# EAGLE design 128A Breakout V1.1 (EAGLE 6.4)
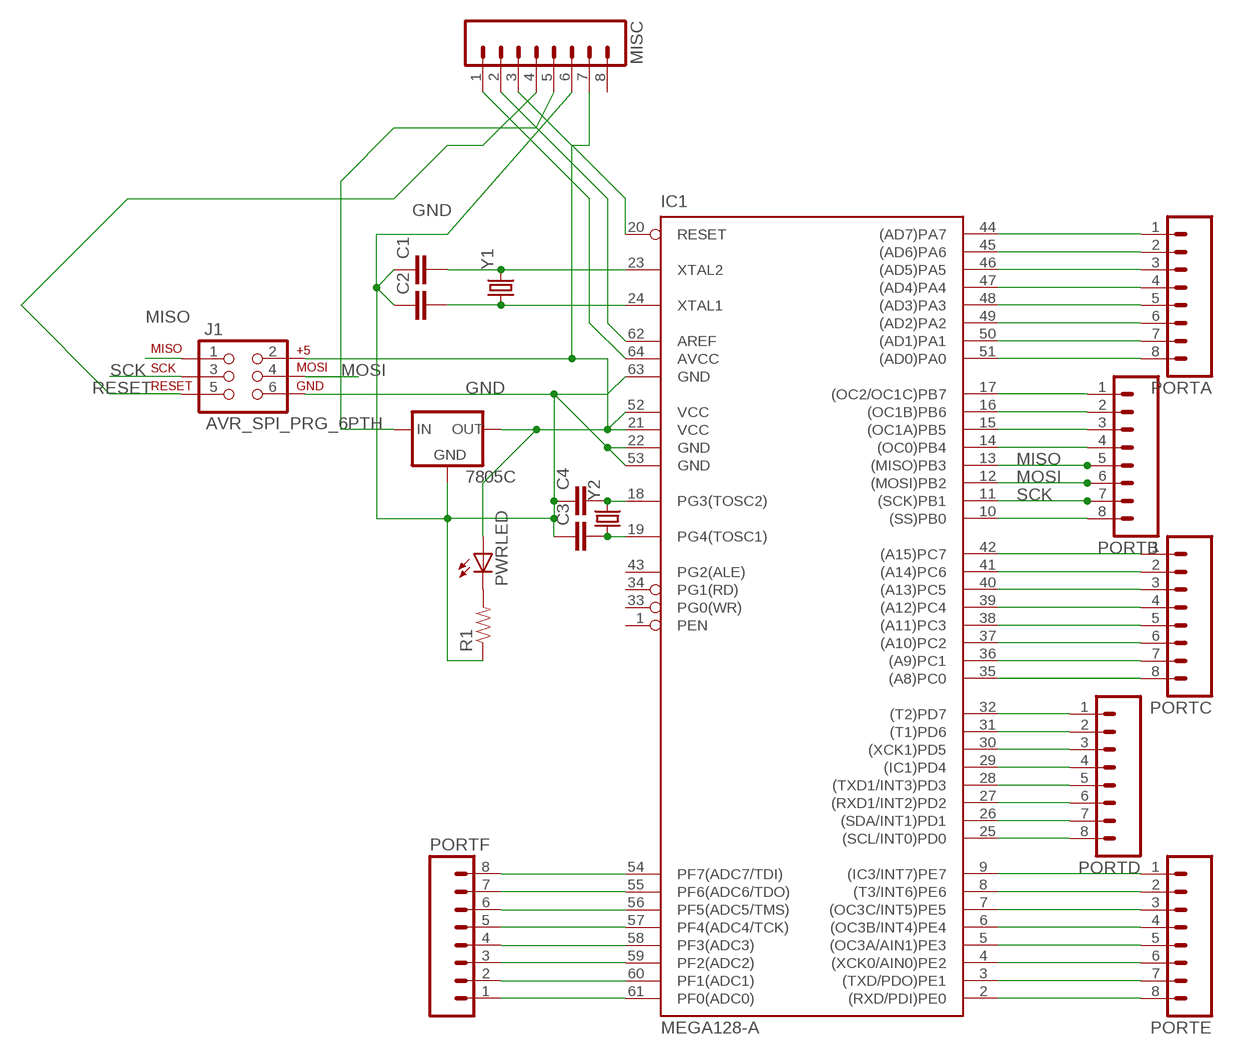
[diagram p0: schematic, sheet 1]

## Parts
7805C  V_REG_78XXSIDE  [78XXL]
C1  CAP1206  [1206]
C2  CAP1206  [1206]
C3  CAP1206  [1206]
C4  CAP1206  [1206]
IC1  MEGA128-A  [TQFP64]
J1  AVR_SPI_PRG_6PTH  [2X3]
MISC  M081X08  [1X08]
PORTA  M081X08  [1X08]
PORTB  M081X08  [1X08]
PORTC  M081X08  [1X08]
PORTD  M081X08  [1X08]
PORTE  M081X08  [1X08]
PORTF  M081X08  [1X08]
PWRLED  LED-FKIT-1206  [FKIT-LED-1206]
R1  RESISTOR1206  [1206]
Y1  CRYSTALHC49US  [HC49US]
Y2  CRYSTALTC26H_EZ  [TC26HEZ]

## Nets
5V: 7805C.OUT IC1.21(VCC) IC1.52(VCC) J1.2 MISC.7 PWRLED.A
GND: 7805C.GND C1.1 C2.1 C3.1 C4.1 IC1.22(GND) IC1.53(GND) IC1.63(GND) J1.6 MISC.6 R1.1
MISO: IC1.13((MISO)PB3) J1.1 PORTB.5
MOSI: IC1.12((MOSI)PB2) J1.4 PORTB.6
N$1: IC1.54(PF7(ADC7/TDI)) PORTF.8
N$2: C4.2 IC1.18(PG3(TOSC2)) Y2.2
N$3: C2.2 IC1.24(XTAL1) Y1.1
N$4: C1.2 IC1.23(XTAL2) Y1.2
N$5: IC1.55(PF6(ADC6/TDO)) PORTF.7
N$6: C3.2 IC1.19(PG4(TOSC1)) Y2.1
N$7: IC1.56(PF5(ADC5/TMS)) PORTF.6
N$8: IC1.57(PF4(ADC4/TCK)) PORTF.5
N$9: IC1.58(PF3(ADC3)) PORTF.4
N$10: IC1.59(PF2(ADC2)) PORTF.3
N$11: IC1.60(PF1(ADC1)) PORTF.2
N$12: IC1.61(PF0(ADC0)) PORTF.1
N$13: IC1.9((IC3/INT7)PE7) PORTE.1
N$14: IC1.8((T3/INT6)PE6) PORTE.2
N$15: IC1.7((OC3C/INT5)PE5) PORTE.3
N$16: IC1.6((OC3B/INT4)PE4) PORTE.4
N$17: IC1.5((OC3A/AIN1)PE3) PORTE.5
N$18: IC1.4((XCK0/AIN0)PE2) PORTE.6
N$19: IC1.3((TXD/PDO)PE1) PORTE.7
N$20: IC1.2((RXD/PDI)PE0) PORTE.8
N$21: IC1.32((T2)PD7) PORTD.1
N$22: IC1.31((T1)PD6) PORTD.2
N$23: IC1.30((XCK1)PD5) PORTD.3
N$24: IC1.29((IC1)PD4) PORTD.4
N$25: IC1.28((TXD1/INT3)PD3) PORTD.5
N$26: IC1.27((RXD1/INT2)PD2) PORTD.6
N$27: IC1.26((SDA/INT1)PD1) PORTD.7
N$28: IC1.25((SCL/INT0)PD0) PORTD.8
N$29: IC1.42((A15)PC7) PORTC.1
N$30: IC1.41((A14)PC6) PORTC.2
N$31: IC1.40((A13)PC5) PORTC.3
N$32: IC1.39((A12)PC4) PORTC.4
N$33: IC1.38((A11)PC3) PORTC.5
N$34: IC1.37((A10)PC2) PORTC.6
N$35: IC1.36((A9)PC1) PORTC.7
N$36: IC1.35((A8)PC0) PORTC.8
N$37: IC1.17((OC2/OC1C)PB7) PORTB.1
N$38: IC1.16((OC1B)PB6) PORTB.2
N$39: IC1.15((OC1A)PB5) PORTB.3
N$40: IC1.14((OC0)PB4) PORTB.4
N$41: IC1.10((SS)PB0) PORTB.8
N$42: IC1.44((AD7)PA7) PORTA.1
N$43: IC1.45((AD6)PA6) PORTA.2
N$44: IC1.46((AD5)PA5) PORTA.3
N$45: IC1.47((AD4)PA4) PORTA.4
N$46: IC1.48((AD3)PA3) PORTA.5
N$47: IC1.49((AD2)PA2) PORTA.6
N$48: IC1.50((AD1)PA1) PORTA.7
N$49: IC1.51((AD0)PA0) PORTA.8
N$50: IC1.64(AVCC) MISC.1
N$51: IC1.62(AREF) MISC.2
N$52: IC1.20(RESET) MISC.3
N$53: PWRLED.C R1.2
RESET: J1.5 MISC.4
SCK: IC1.11((SCK)PB1) J1.3 PORTB.7
VIN: 7805C.IN MISC.5
Unconnected: IC1.1(PEN) IC1.33(PG0(WR)) IC1.34(PG1(RD)) IC1.43(PG2(ALE)) MISC.8

## Library data of the parts
7805C = SparkFun-PowerIC:V_REG_78XX: Voltage Regulator Standard 7805 5V regulator. IGO (Input Ground Output). Spark Fun Electronics SKU : COM-00107
C1-C4 = SparkFun-Passives:CAP: Capacitor Standard 0603 ceramic capacitor, and 0.1" leaded capacitor.
IC1 = atmel:MEGA128: MICROCONTROLLER 128 Kbytes FLASH 4 Kbytes SRAM 4 Kbytes EEPROM DUAL USART 8-channel 10 bit ADC Source: avr.lbr; MPN: ATMEGA128-16AU; OC_FARNELL: 9171118; OC_NEWARK: 95K7364
J1 = SparkFun-Connectors:AVR_SPI_PRG_6: AVR ISP 6 Pin This is the reduced ISP connector for AVR programming. Common on Arduino. This footprint will take up less PCB space and can be used with a 10-pin to 6-pin adapter such as SKU: BOB-08508
MISC PORTA PORTB PORTC PORTD PORTE PORTF = SparkFun-Connectors:M08: Header 8 Standard 8-pin 0.1" header. Use with straight break away headers (SKU : PRT-00116), right angle break away headers (PRT-00553), swiss pins (PRT-00743), machine pins (PRT-00117), and female headers (PRT-00115).
PWRLED = SparkFun-LED:LED: LEDs Standard schematic elements and footprints for 5mm, 3mm, 1206, and 0603 sized LEDs. 5mm - Spark Fun Electronics SKU : COM-00529 (and others)
R1 = SparkFun-Resistors:RESISTOR: Resistor Basic schematic elements and footprints for 0603, 1206, and PTH resistors.
Y1 Y2 = SparkFun-FreqCtrl:CRYSTAL: Various standard crystals. Proven footprints. Spark Fun Electronics SKU : COM-00534

## Board
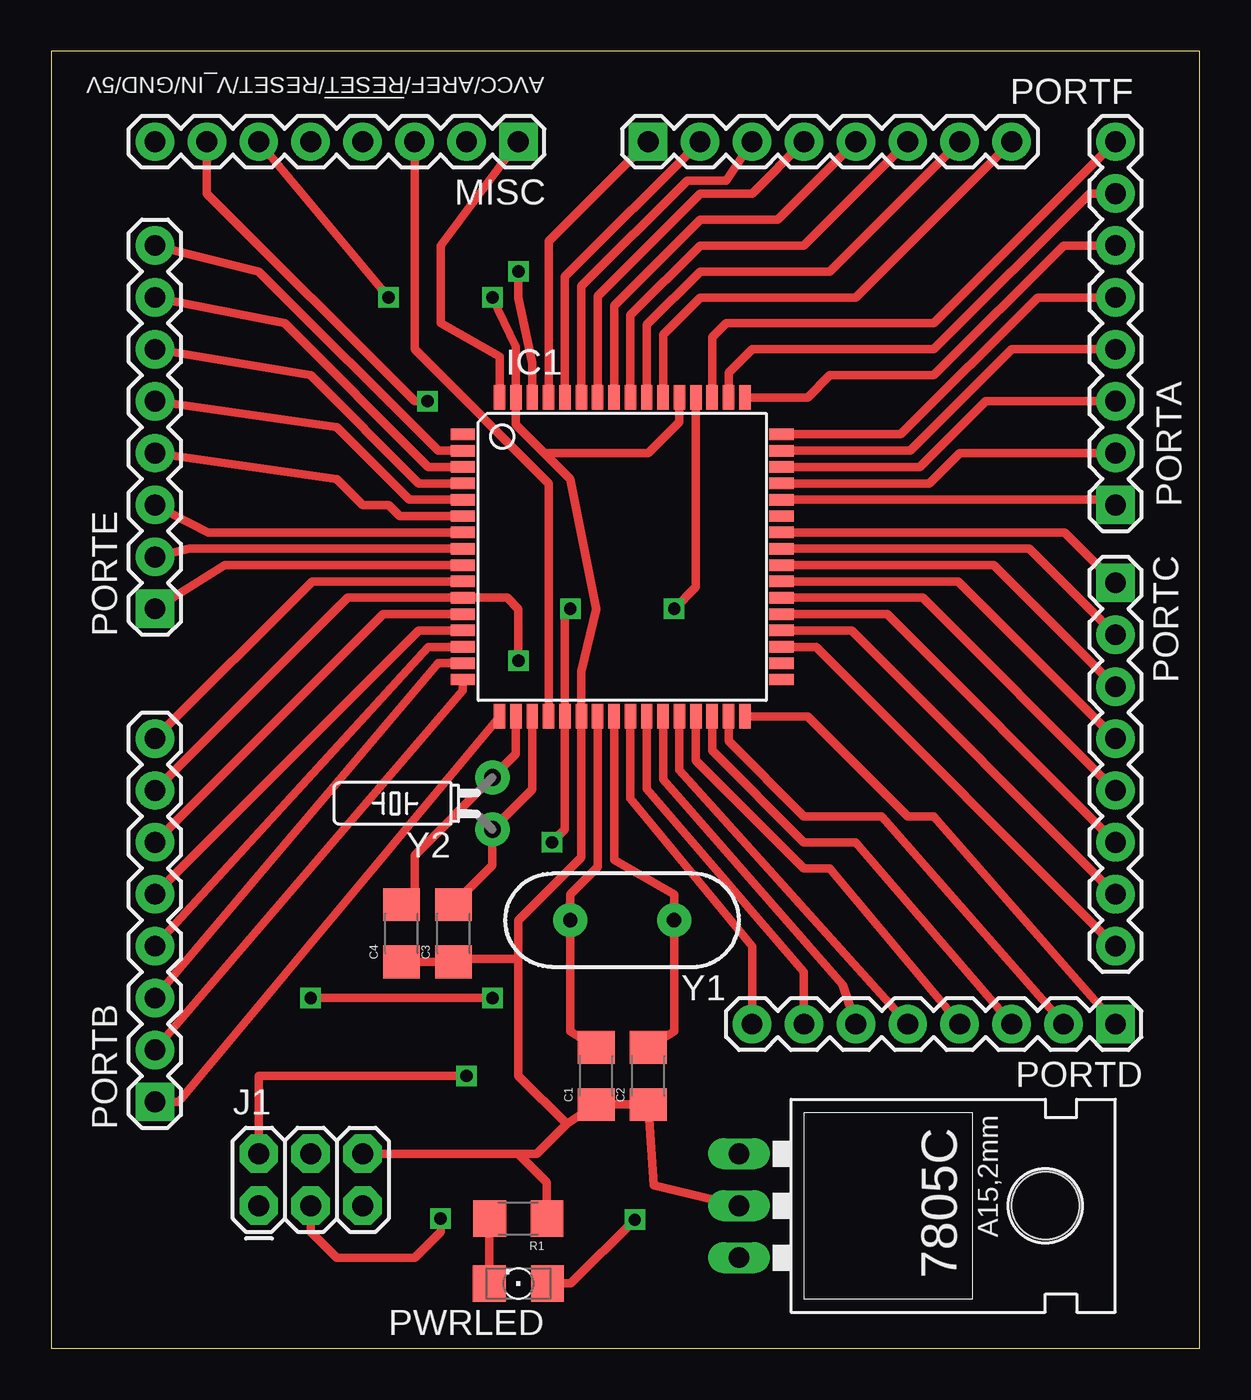
[diagram p1: board, top side]
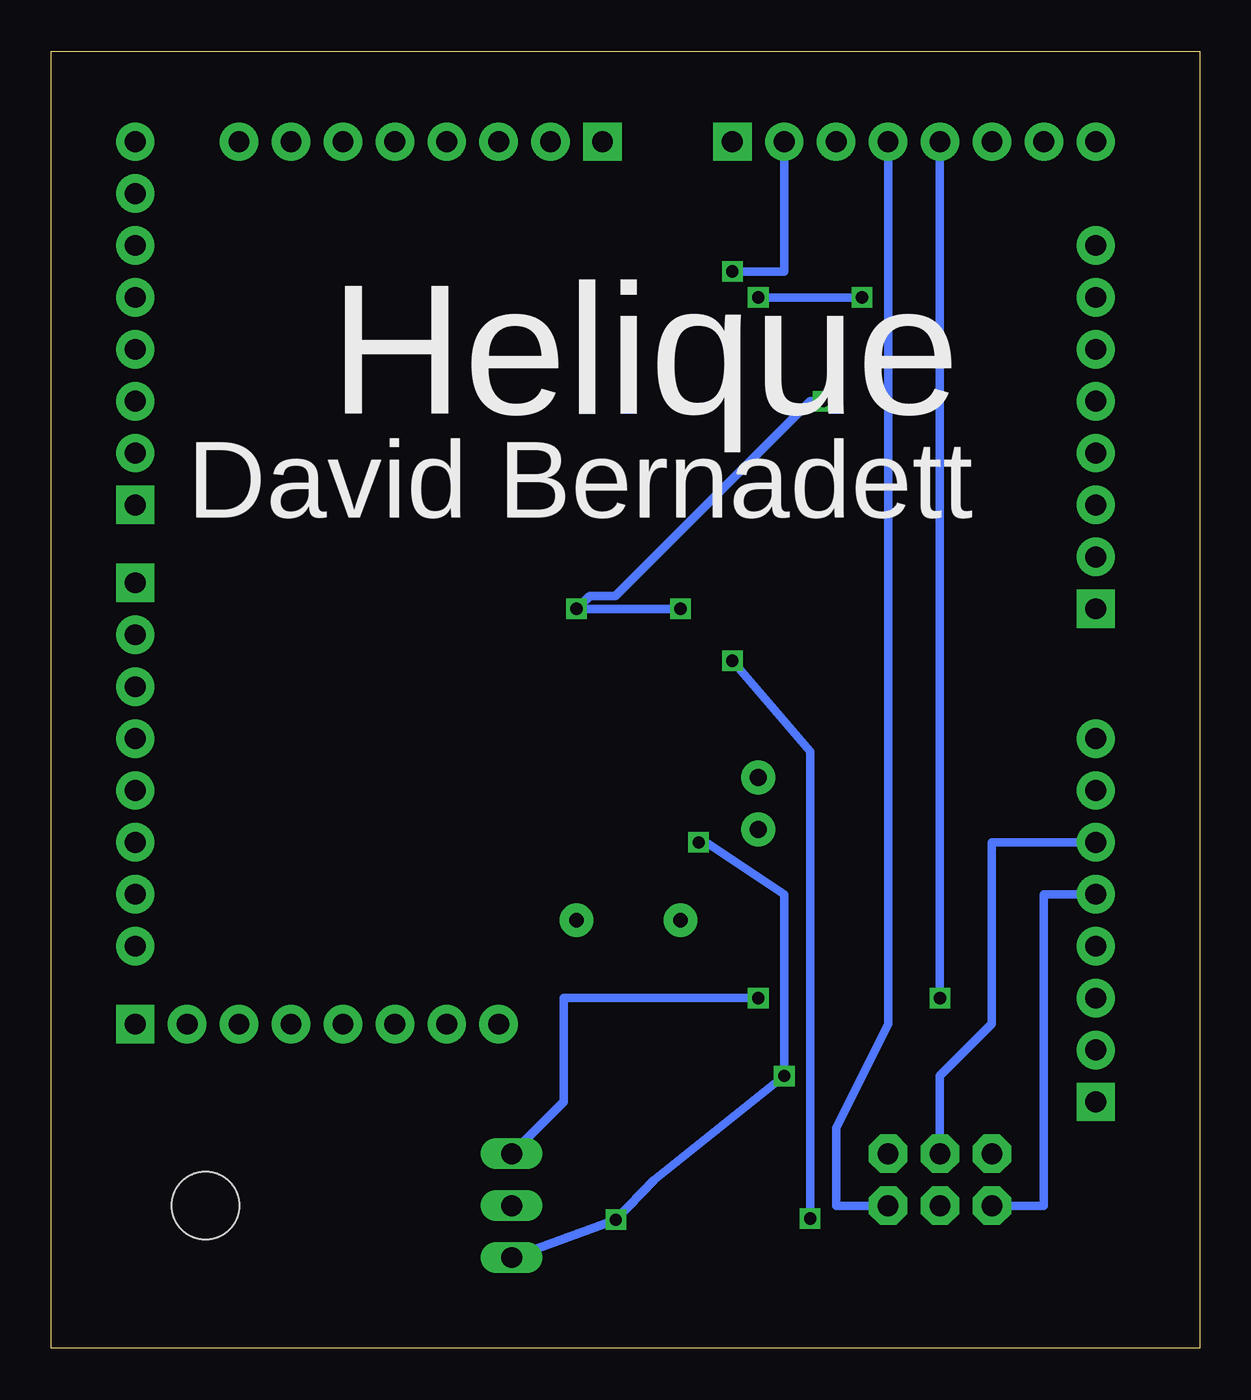
[diagram p2: board, bottom side, seen from below]

Size 56.19 x 63.49 mm. Coordinates in mm from the lower left corner, seen from the top.
Outline: 0,0 56.19,0 56.19,63.49 0,63.49 0,0
Copper layers (1*16): Top 0.035mm / dielectric 1.5mm / Bottom 0.035mm
Design rules "default": minimum track width 10mil, minimum drill 24mil, track to track 8mil, track to pad 8mil, pad to pad 8mil, via to via 8mil, smd to smd 8mil, copper to edge 40mil, drill to drill 8mil, minimum pad ring 10mil, minimum via ring 8mil, stop-mask expansion 4mil, vias tented up to drill 0mil, thermal gap 10mil

### Footprints (pad centres in the part's own frame; a part is rotated, then mirrored left to right if it is on the bottom)
78XXL = drill 1.016 long: GND 0,-3.81; IN -2.54,-3.81; OUT 2.54,-3.81 | hole 3.302: 0,11.176
1206 = smd 1.6 x 1.8: 1 -1.4,0; 2 1.4,0
TQFP64 = smd 1.194 x 0.559: 1 -7.8,6; 2 -7.8,5.2; 3 -7.8,4.4; 4 -7.8,3.6; 5 -7.8,2.8; 6 -7.8,2; 7 -7.8,1.2; 8 -7.8,0.4; 9 -7.8,-0.4; 10 -7.8,-1.2; 11 -7.8,-2; 12 -7.8,-2.8; 13 -7.8,-3.6; 14 -7.8,-4.4; 15 -7.8,-5.2; 16 -7.8,-6; 33 7.8,-6; 34 7.8,-5.2; 35 7.8,-4.4; 36 7.8,-3.6; 37 7.8,-2.8; 38 7.8,-2; 39 7.8,-1.2; 40 7.8,-0.4; 41 7.8,0.4; 42 7.8,1.2; 43 7.8,2; 44 7.8,2.8; 45 7.8,3.6; 46 7.8,4.4; 47 7.8,5.2; 48 7.8,6 | smd 0.559 x 1.194: 17 -6,-7.8; 18 -5.2,-7.8; 19 -4.4,-7.8; 20 -3.6,-7.8; 21 -2.8,-7.8; 22 -2,-7.8; 23 -1.2,-7.8; 24 -0.4,-7.8; 25 0.4,-7.8; 26 1.2,-7.8; 27 2,-7.8; 28 2.8,-7.8; 29 3.6,-7.8; 30 4.4,-7.8; 31 5.2,-7.8; 32 6,-7.8; 49 6,7.8; 50 5.2,7.8; 51 4.4,7.8; 52 3.6,7.8; 53 2.8,7.8; 54 2,7.8; 55 1.2,7.8; 56 0.4,7.8; 57 -0.4,7.8; 58 -1.2,7.8; 59 -2,7.8; 60 -2.8,7.8; 61 -3.6,7.8; 62 -4.4,7.8; 63 -5.2,7.8; 64 -6,7.8
2X3 = drill 1.016 pad 1.88 octagon: 1 0,0; 2 0,2.54; 3 2.54,0; 4 2.54,2.54; 5 5.08,0; 6 5.08,2.54
1X08 = drill 1.016 pad 1.88 square: 1 0,0 | drill 1.016 pad 1.88: 2 2.54,0; 3 5.08,0; 4 7.62,0; 5 10.16,0; 6 12.7,0; 7 15.24,0; 8 17.78,0
FKIT-LED-1206 = smd 1.6 x 1.803: A -1.422,0; C 1.422,0
HC49US = drill 0.7 pad 1.651: 1 -2.54,0; 2 2.54,0
TC26HEZ = drill 0.813 pad 1.676: 1 -1.27,0; 2 1.27,0

### Placement (x,y rotation side)
7805C  37.47,6.99 270 top
C1  26.67,13.34 90 top
C2  29.21,13.34 90 top
C3  19.68,20.32 90 top
C4  17.14,20.32 90 top
IC1  27.94,38.73 0 top
J1  10.16,6.99 0 top
MISC  22.86,59.05 180 top
PORTA  52.07,41.27 90 top
PORTB  5.08,12.06 90 top
PORTC  52.07,37.47 270 top
PORTD  52.07,15.88 180 top
PORTE  5.08,36.2 90 top
PORTF  29.21,59.05 0 top
PWRLED  22.86,3.17 180 top
R1  22.86,6.35 180 top
Y1  27.94,20.95 180 top
Y2  21.59,26.67 90 top

### Tracks (layer width: path | path; a pad name or v marks a point on that pad's centre or on a via)
5V  (via drill 0.6)
  Top 0.406: IC1.52 31.54,37.26 v30.48,36.2 | v25.4,36.2 25.14,35.94 IC1.21 25.14,25.4 v24.5,24.77 | v20.32,13.34 10.16,13.34 J1.2 | PWRLED.A 25.43,3.17 v28.56,6.3 | MISC.7 7.62,56.52 17.78,46.35 v18.41,46.35
  Bottom 0.406: v25.4,36.2 v30.48,36.2 29.84,36.83 28.57,36.83 19.05,46.35 v18.41,46.35 | 7805C.OUT v28.56,6.3 26.67,8.26 v20.32,13.34 20.32,22.23 24.13,24.77 v24.5,24.77
GND  (via drill 0.6)
  Top 0.406: 24.13,43.81 22.74,45.2 IC1.63 22.74,49.02 v21.59,51.44 | 24.13,43.81 29.21,43.81 30.74,45.34 IC1.53 | 7805C.GND 29.48,7.99 C2.1 C1.1 25.21,10.98 | J1.6 22.86,9.53 | 22.86,9.53 23.76,9.53 25.21,10.98 | 24.13,43.81 25.4,42.55 26.67,36.2 25.94,33.12 IC1.22 25.94,24.04 22.86,20.95 22.86,19.05 | 22.86,19.05 22.86,13.34 25.21,10.98 | v16.51,51.44 MISC.6 | R1.1 24.26,8.12 22.86,9.53 | 22.86,19.05 19.82,19.05 C3.1 C4.1
  Bottom 0.406: v21.59,51.44 v16.51,51.44
MISO
  Top 0.406: IC1.13 17.99,35.13 PORTB.5
  Bottom 0.406: J1.1 7.62,6.99 7.62,22.23 PORTB.5
MOSI
  Top 0.406: IC1.12 16.25,35.94 PORTB.6
  Bottom 0.406: J1.4 12.7,13.34 10.16,15.88 10.16,24.77 PORTB.6
N$1
  Top 0.406: IC1.54 29.94,49.62 31.75,51.44 39.37,51.44 PORTF.8
N$2
  Top 0.406: C4.2 17.78,22.36 17.78,24.13 Y2.2 22.74,29.09 IC1.18
N$3
  Top 0.406: IC1.24 27.54,23.89 30.48,22.23 Y1.1 30.48,15.51 C2.2
N$4
  Top 0.406: IC1.23 26.74,23.57 25.4,22.23 Y1.2 25.4,15.51 C1.2
N$5
  Top 0.406: IC1.55 29.14,50.09 31.75,52.7 38.1,52.7 PORTF.7
N$6
  Top 0.406: C3.2 21.59,23.62 Y2.1 23.54,27.35 IC1.19
N$7
  Top 0.406: IC1.56 28.34,50.56 31.75,53.98 36.83,53.98 PORTF.6
N$8
  Top 0.406: IC1.57 27.54,51.03 31.75,55.24 35.56,55.24 PORTF.5
N$9
  Top 0.406: IC1.58 26.74,51.51 31.75,56.52 34.29,56.52 PORTF.4
N$10
  Top 0.406: IC1.59 25.94,51.98 31.11,57.15 33.02,57.15 PORTF.3
N$11
  Top 0.406: IC1.60 25.14,52.45 PORTF.2
N$12
  Top 0.406: IC1.61 24.34,54.19 PORTF.1
N$13
  Top 0.406: IC1.9 8.49,38.34 PORTE.1
N$14
  Top 0.406: IC1.8 6.75,39.13 PORTE.2
N$15
  Top 0.406: IC1.7 7.69,39.94 PORTE.3
N$16
  Top 0.406: IC1.6 17.05,40.73 16.51,41.27 15.24,41.27 13.97,42.55 PORTE.4
N$17
  Top 0.406: IC1.5 17.52,41.53 13.97,45.09 PORTE.5
N$18
  Top 0.406: IC1.4 17.99,42.34 12.7,47.62 PORTE.6
N$19
  Top 0.406: IC1.3 18.46,43.13 11.43,50.16 PORTE.7
N$20
  Top 0.406: IC1.2 18.93,43.94 10.16,52.7 PORTE.8
N$21
  Top 0.406: IC1.32 37.01,30.93 41.91,26.04 43.18,26.04 PORTD.1
N$22
  Top 0.406: IC1.31 33.14,29.73 36.83,26.04 40.64,26.04 PORTD.2
N$23
  Top 0.406: IC1.30 32.34,29.25 36.83,24.77 39.37,24.77 PORTD.3
N$24
  Top 0.406: IC1.29 31.54,28.79 36.83,23.5 38.1,23.5 PORTD.4
N$25
  Top 0.406: IC1.28 30.74,28.32 PORTD.5
N$26
  Top 0.406: IC1.27 29.94,27.84 38.73,17.78 PORTD.6
N$27
  Top 0.406: IC1.26 29.14,27.38 36.83,18.41 PORTD.7
N$28
  Top 0.406: IC1.25 28.34,26.91 34.29,19.68 PORTD.8
N$29
  Top 0.406: IC1.42 49.6,39.94 PORTC.1
N$30
  Top 0.406: IC1.41 47.86,39.13 PORTC.2
N$31
  Top 0.406: IC1.40 46.12,38.34 PORTC.3
N$32
  Top 0.406: IC1.39 44.38,37.53 PORTC.4
N$33
  Top 0.406: IC1.38 42.64,36.73 PORTC.5
N$34
  Top 0.406: IC1.37 40.9,35.94 PORTC.6
N$35
  Top 0.406: IC1.36 39.16,35.13 PORTC.7
N$36
  Top 0.406: IC1.35 37.42,34.34 PORTC.8
N$37
  Top 0.406: PORTB.1 6.25,12.06 IC1.17
N$38
  Top 0.406: IC1.16 20.14,32.2 PORTB.2
N$39
  Top 0.406: IC1.15 18.93,33.53 PORTB.3
N$40
  Top 0.406: IC1.14 18.46,34.34 PORTB.4
N$41
  Top 0.406: IC1.10 12.77,37.53 PORTB.8
N$42
  Top 0.406: IC1.44 51.81,41.53 PORTA.1
N$43
  Top 0.406: IC1.45 42.97,42.34 44.45,43.81 PORTA.2
N$44
  Top 0.406: IC1.46 42.5,43.13 45.72,46.35 PORTA.3
N$45
  Top 0.406: IC1.47 42.03,43.94 46.99,48.9 PORTA.4
N$46
  Top 0.406: IC1.48 41.56,44.73 48.26,51.44 PORTA.5
N$47
  Top 0.406: IC1.49 37.01,46.53 38.1,47.62 43.18,47.62 49.53,53.98 PORTA.6
N$48
  Top 0.406: IC1.50 33.14,47.74 34.29,48.9 43.18,48.9 50.8,56.52 PORTA.7
N$49
  Top 0.406: IC1.51 32.34,49.48 33.02,50.16 43.18,50.16 PORTA.8
N$50
  Top 0.406: MISC.1 19.05,53.98 19.05,50.16 21.94,48.55 IC1.64
N$51  (via drill 0.6)
  Top 0.406: v22.86,52.7 22.86,51.44 23.54,48.22 IC1.62
  Bottom 0.406: MISC.2 20.32,52.7 v22.86,52.7
N$52
  Top 0.406: IC1.20 24.34,42.34 17.78,48.9 MISC.3
N$53
  Top 0.406: PWRLED.C 21.44,6.33 R1.2
RESET
  Bottom 0.406: MISC.4 15.24,15.88 17.78,10.79 17.78,6.99 J1.5
SCK  (via drill 0.6)
  Top 0.406: PORTB.7 14.51,36.73 IC1.11 22.32,36.73 22.86,36.2 v22.86,33.66 | J1.3 12.7,5.71 13.97,4.45 17.78,4.45 19.05,5.71 v19.05,6.35
  Bottom 0.406: v19.05,6.35 19.05,29.21 v22.86,33.66
VIN  (via drill 0.6)
  Top 0.406: v12.7,17.14 v21.59,17.14
  Bottom 0.406: MISC.5 v12.7,17.14 | 7805C.IN 31.11,12.06 31.11,17.14 v21.59,17.14

### Text on the board
tNames: AVCC/AREF/!RESET!/RESET/V_IN/GND/5V
bNames: Helique | David Bernadett